# Altium schematic sheet OuterRing.SchDoc
size A4
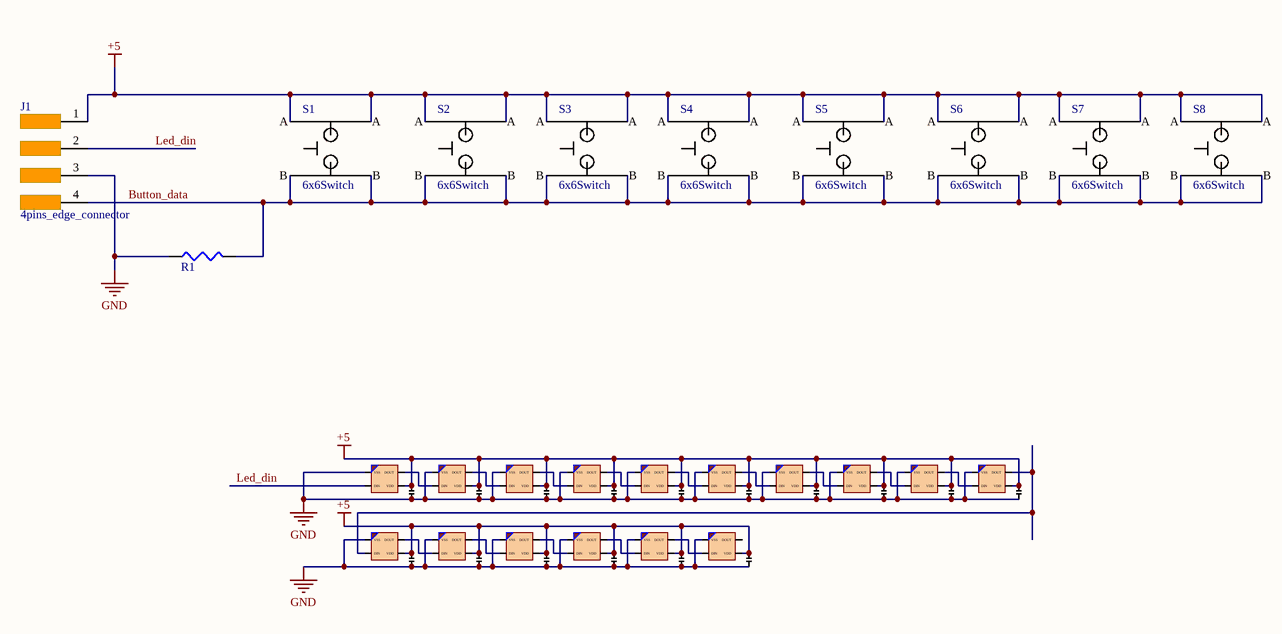
[diagram p0: OuterRing.SchDoc]

## Parts
C1  capacitor0.1uf  [Capacitor0805]  (value not drawn)
C2  capacitor0.1uf  [Capacitor0805]  (value not drawn)
C3  capacitor0.1uf  [Capacitor0805]  (value not drawn)
C4  capacitor0.1uf  [Capacitor0805]  (value not drawn)
C5  capacitor0.1uf  [Capacitor0805]  (value not drawn)
C6  capacitor0.1uf  [Capacitor0805]  (value not drawn)
C7  capacitor0.1uf  [Capacitor0805]  (value not drawn)
C8  capacitor0.1uf  [Capacitor0805]  (value not drawn)
C9  capacitor0.1uf  [Capacitor0805]  (value not drawn)
C10  capacitor0.1uf  [Capacitor0805]  (value not drawn)
C11  capacitor0.1uf  [Capacitor0805]  (value not drawn)
C12  capacitor0.1uf  [Capacitor0805]  (value not drawn)
C13  capacitor0.1uf  [Capacitor0805]  (value not drawn)
C14  capacitor0.1uf  [Capacitor0805]  (value not drawn)
C15  capacitor0.1uf  [Capacitor0805]  (value not drawn)
C16  capacitor0.1uf  [Capacitor0805]  (value not drawn)
J1  4pins_edge_connector  [4pins_edge_connector]
LED1  Ws2812B  [ws2812b]  (value not drawn)
LED2  Ws2812B  [ws2812b]  (value not drawn)
LED3  Ws2812B  [ws2812b]  (value not drawn)
LED4  Ws2812B  [ws2812b]  (value not drawn)
LED5  Ws2812B  [ws2812b]  (value not drawn)
LED6  Ws2812B  [ws2812b]  (value not drawn)
LED7  Ws2812B  [ws2812b]  (value not drawn)
LED8  Ws2812B  [ws2812b]  (value not drawn)
LED9  Ws2812B  [ws2812b]  (value not drawn)
LED10  Ws2812B  [ws2812b]  (value not drawn)
LED11  Ws2812B  [ws2812b]  (value not drawn)
LED12  Ws2812B  [ws2812b]  (value not drawn)
LED13  Ws2812B  [ws2812b]  (value not drawn)
LED14  Ws2812B  [ws2812b]  (value not drawn)
LED15  Ws2812B  [ws2812b]  (value not drawn)
LED16  Ws2812B  [ws2812b]  (value not drawn)
R1  10K  [R0805]  (value not drawn)
S1  6x6Switch  [6x6Switch]
S2  6x6Switch  [6x6Switch]
S3  6x6Switch  [6x6Switch]
S4  6x6Switch  [6x6Switch]
S5  6x6Switch  [6x6Switch]
S6  6x6Switch  [6x6Switch]
S7  6x6Switch  [6x6Switch]
S8  6x6Switch  [6x6Switch]

## Nets
+5: C1.2(+) C2.2(+) C3.2(+) C4.2(+) C5.2(+) C6.2(+) C7.2(+) C8.2(+) C9.2(+) C10.2(+) C11.2(+) C12.2(+) C13.2(+) C14.2(+) C15.2(+) C16.2(+) J1.1(+5v) LED1.1(VDD) LED2.1(VDD) LED3.1(VDD) LED4.1(VDD) LED5.1(VDD) LED6.1(VDD) LED7.1(VDD) LED8.1(VDD) LED9.1(VDD) LED10.1(VDD) LED11.1(VDD) LED12.1(VDD) LED13.1(VDD) LED14.1(VDD) LED15.1(VDD) LED16.1(VDD) S1.1(A) S1.4(A) S2.1(A) S2.4(A) S3.1(A) S3.4(A) S4.1(A) S4.4(A) S5.1(A) S5.4(A) S6.1(A) S6.4(A) S7.1(A) S7.4(A) S8.1(A) S8.4(A)
GND: C1.1(-) C2.1(-) C3.1(-) C4.1(-) C5.1(-) C6.1(-) C7.1(-) C8.1(-) C9.1(-) C10.1(-) C11.1(-) C12.1(-) C13.1(-) C14.1(-) C15.1(-) C16.1(-) J1.3(GND) LED1.3(VSS) LED2.3(VSS) LED3.3(VSS) LED4.3(VSS) LED5.3(VSS) LED6.3(VSS) LED7.3(VSS) LED8.3(VSS) LED9.3(VSS) LED10.3(VSS) LED11.3(VSS) LED12.3(VSS) LED13.3(VSS) LED14.3(VSS) LED15.3(VSS) LED16.3(VSS) R1.1
Button_data: J1.4(Button) R1.2 S1.2(B) S1.3(B) S2.2(B) S2.3(B) S3.2(B) S3.3(B) S4.2(B) S4.3(B) S5.2(B) S5.3(B) S6.2(B) S6.3(B) S7.2(B) S7.3(B) S8.2(B) S8.3(B)
Led_din: J1.2(Data) LED1.4(DIN)
NetLED1_2: LED1.2(DOUT) LED2.4(DIN)
NetLED2_2: LED2.2(DOUT) LED3.4(DIN)
NetLED3_2: LED3.2(DOUT) LED4.4(DIN)
NetLED4_2: LED4.2(DOUT) LED5.4(DIN)
NetLED5_2: LED5.2(DOUT) LED6.4(DIN)
NetLED6_2: LED6.2(DOUT) LED7.4(DIN)
NetLED7_2: LED7.2(DOUT) LED8.4(DIN)
NetLED8_2: LED8.2(DOUT) LED9.4(DIN)
NetLED9_2: LED9.2(DOUT) LED10.4(DIN)
NetLED10_2: LED10.2(DOUT) LED11.4(DIN)
NetLED11_2: LED11.2(DOUT) LED12.4(DIN)
NetLED12_2: LED12.2(DOUT) LED13.4(DIN)
NetLED13_2: LED13.2(DOUT) LED14.4(DIN)
NetLED14_2: LED14.2(DOUT) LED15.4(DIN)
NetLED15_2: LED15.2(DOUT) LED16.4(DIN)

Not connected (* = marked no-connect by the designer): LED16 2(DOUT)

## Library data of the parts
C1-C16 = capacitor0.1uf: for leds and smol
R1 = resistor(CRCW0805360RFKEA: Res Thick Film 0805 360 Ohm 1% 0.125W(1/8W) ±100ppm/C Molded SMD Automotive Paper T/R; Manufacturer 1: Vishay; Resistance: 360R; Temperature Coefficient: 100ppm/°C; Max Power Dissipation: 125mW; Voltage Rating (DC): 150V; Supplier 1: Digi-Key; Manufacturer Part Number 1: CRCW0805360RFKEA; RoHS: Yes; Category: Chip SMD Resistors; Stock 1: 25005; Pricing 1: 1=0.10000, 10=0.06000, 100=0.02450, 1000=0.01102, 2500=0.00957 (USD); Case/Package: 0805; Number of Pins: 2; Weight: 0.000194oz; Case Code (Metric): 2012; Case Code (Imperial): 0805; Contact Plating: Tin; Number of Terminals: 2; Min Operating Temperature: -55°C; Max Operating Temperature: 155°C; Tolerance: 1%; Packaging: Tape and Reel; Composition: Thick Film; Package Quantity: 10; Number of Terminations: 2; Features: Automotive AEC-Q200; Power Rating: 125mW; Voltage Rating: 150V; Termination: SMD/SMT; Military Standard: Not; Length: 2mm; Height: 0.45mm; Width: 0.049inch; Depth: 1.25mm; Radiation Hardening: No; Lead Free: Lead Free; REACH SVHC: Unknown; ComponentLink1URL: https://datasheet.ciiva.com/2467/dcrcwe3-2467773.pdf?src-supplier=Digi-Key; ComponentLink1Description: https://datasheet.ciiva.com/2467/dcrcwe3-2467773.pdf?src-supplier=Digi-Key; Supplier Part Number 1: 541-360CCT-ND